# EAGLE design Base (EAGLE 6.4)
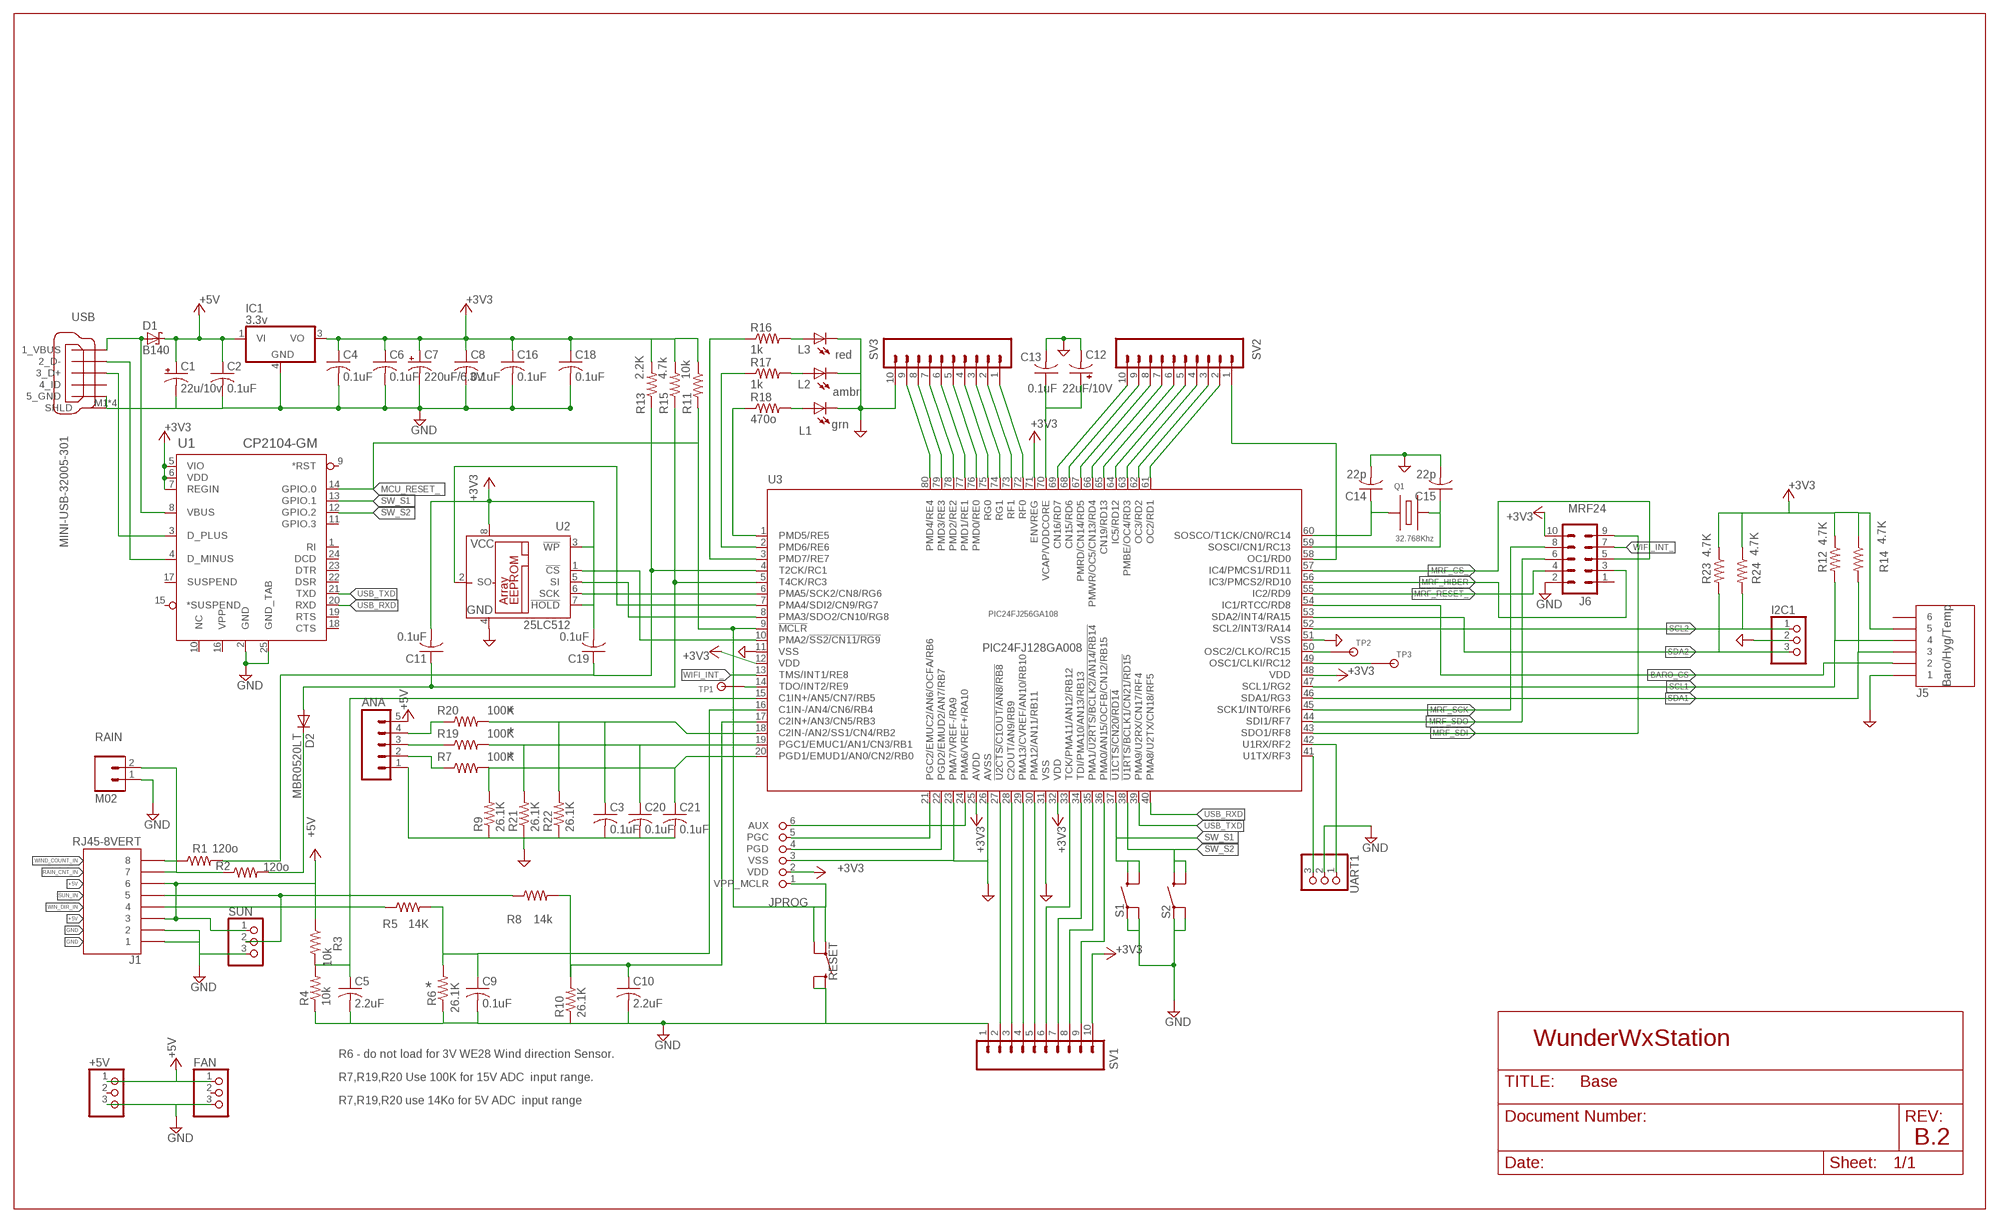
[diagram p0: schematic, sheet 1]

## Parts
+5V  PINHD-1X3MOLEX_KK  [1X3_MOLEX_KK]
ANA  M05PTH  [1X05]
C1  22u/10v  CPOL-USSMCB  [SMC_B]
C2  0.1uF  C-USC0805  [C0805]
C3  0.1uF  C-USC0805  [C0805]
C4  0.1uF  C-USC0805  [C0805]
C5  2.2uF  C-USC0805  [C0805]
C6  0.1uF  C-USC0805  [C0805]
C7  220uF/6.3V  CPOL-USSMCD  [SMC_D]
C8  0.1uF  C-USC0805  [C0805]
C9  0.1uF  C-USC0805  [C0805]
C10  2.2uF  C-USC0805  [C0805]
C11  0.1uF  C-USC0805  [C0805]
C12  22uF/10V  CPOL-USSMCB  [SMC_B]
C13  0.1uF  C-USC0805  [C0805]
C14  22p  C-USC0603  [C0603]
C15  22p  C-USC0603  [C0603]
C16  0.1uF  C-USC0805  [C0805]
C18  0.1uF  C-USC0805  [C0805]
C19  0.1uF  C-USC0805  [C0805]
C20  0.1uF  C-USC0805  [C0805]
C21  0.1uF  C-USC0805  [C0805]
D1  B140  SCHOTTKY-DIODESMD  [SMB]
D2  MBR0520LT  [SOD123]
FAN  PINHD-1X3MOLEX_KK  [1X3_MOLEX_KK]
I2C1  PINHD-1X3  [1X03]
IC1  3.3v  78MXXL  [DPACK]
J1  RJ45-8VERT  [RJ45_VERT]
J5  RJ11-6VERT_LP  [RJ11-6-VERT]
J6  M05X22X5FE  [2X5FEMALE]
JPROG  PIKIT2_PRG  [1X06_PIKIT]
L1  grn  LEDCHIP-LED0603  [CHIP-LED0603]
L2  ambr  LEDCHIP-LED0603  [CHIP-LED0603]
L3  red  LEDCHIP-LED0603  [CHIP-LED0603]
Q1  32.768Khz  CRYSTAL  [CRYSTAL32_SMT]
R1  120o  R-US_R0603  [R0603]
R2  120o  R-US_R0603  [R0603]
R3  10k  R-US_R0603  [R0603]
R4  10k  R-US_R0603  [R0603]
R5  14K  R-US_R0603  [R0603]
R6  26.1K  R-US_R0603  [R0603]
R7  100K  R-US_R0603  [R0603]
R8  14k  R-US_R0603  [R0603]
R9  26.1K  R-US_R0603  [R0603]
R10  26.1K  R-US_R0603  [R0603]
R11  10k  R-US_R0603  [R0603]
R12  4.7K  R-US_R0603  [R0603]
R13  2.2K  R-US_R0603  [R0603]
R14  4.7K  R-US_R0603  [R0603]
R15  4.7k  R-US_R0603  [R0603]
R16  1k  R-US_R0603  [R0603]
R17  1k  R-US_R0603  [R0603]
R18  470o  R-US_R0603  [R0603]
R19  100K  R-US_R0603  [R0603]
R20  100K  R-US_R0603  [R0603]
R21  26.1K  R-US_R0603  [R0603]
R22  26.1K  R-US_R0603  [R0603]
R23  4.7K  R-US_R0603  [R0603]
R24  4.7K  R-US_R0603  [R0603]
RAIN  M02  [1X02]
RESET  SWITCH-MOMENTARY-2SMD  [TACTILE_SWITCH_SMD]
S1  SWITCH-MOMENTARY-2SMD  [TACTILE_SWITCH_SMD]
S2  SWITCH-MOMENTARY-2SMD  [TACTILE_SWITCH_SMD]
SUN  PINHD-1X3MOLEX_KK  [1X3_MOLEX_KK]
SV1  M10"  [1X10]
SV2  M10"  [1X10]
SV3  M10"  [1X10]
TP1  TP10R  [TP10R]
TP2  TP6R  [TP06R]
TP3  TP6R  [TP06R]
U1  CP2104-GM  [QFN24_4X4]
U2  25LC512  25LC080SN  [SO-08]
U3  PIC24FJ128GA008  [TQFP80-12X12]
UART1  PINHD-1X3  [1X03]
USB  MINI-USB-32005-301  [32005-301]

## Nets
+3V3: C4.1 C6.1 C7.+ C8.1 C11.2 C16.1 C18.1 C19.2 IC1.3(VO) J5.P$5 J6.10 JPROG.2(VDD) R11.1 R12.1 R13.2 R14.1 R15.2 R23.1 R24.1 SV1.10 U1.5(VIO) U1.6(VDD) U1.7(REGIN) U2.3(!WP) U2.7(!HOLD) U2.8(VCC) U3.12(VDD) U3.25(AVDD) U3.32(VDD) U3.48(VDD) U3.71(ENVREG)
+5V: +5V.1 ANA.5 C1.+ C2.1 D1.C FAN.1 IC1.1(VI) J1.P$3 J1.P$6 R3.1 SUN.1
BARO_CS: J5.P$2 U3.54(IC1/RTCC/RD8)
GND: +5V.3 ANA.1 C1.- C2.2 C3.2 C4.2 C5.2 C6.2 C7.- C8.2 C9.2 C10.2 C12.- C13.2 C14.2 C15.2 C16.2 C18.2 C20.2 C21.2 FAN.3 I2C1.2 IC1.4(GND) J1.P$1 J1.P$2 J5.P$1 J6.2 JPROG.3(VSS) L1.C L2.C L3.C R4.1 R6.1 R9.1 R10.1 R21.1 R22.1 RAIN.1 RESET.3 RESET.4 S1.1 S1.2 S2.1 S2.2 SUN.3 SV1.1 SV3.10 U1.2(GND) U1.25(GND_TAB) U2.4(GND) U3.11(VSS) U3.23(PMA7/VREF-/RA9) U3.26(AVSS) U3.31(VSS) U3.51(VSS) UART1.2 USB.5_USB_GND(5_GND) USB.M1(SHLD) USB.M2(SHLD) USB.M3(SHLD) USB.M4(SHLD)
MCU_RESET_: JPROG.1(VPP_MCLR) R11.2 RESET.1 RESET.2 U1.14(GPIO.0) U3.9(!MCLR)
MRF_CS_: J6.5 U3.57(IC4/PMCS1/RD11)
MRF_HIBER: J6.3 U3.56(IC3/PMCS2/RD10)
MRF_RESET_: J6.4 U3.55(IC2/RD9)
MRF_SCK: J6.8 U3.45(SCK1/INT0/RF6)
MRF_SDI: J6.9 U3.43(SDO1/RF8)
MRF_SDO: J6.6 U3.44(SDI1/RF7)
N$1: D2.C R2.2
N$2: C15.1 Q1.P$3 U3.59(SOSCI/CN1/RC13)
N$4: TP2.TP_1 U3.50(OSC2/CLKO/RC15)
N$5: R18.1 U3.1(PMD5/RE5)
N$7: C14.1 Q1.P$2 U3.60(SOSCO/T1CK/CN0/RC14)
N$8: TP1.TP_1 U3.14(TDO/INT2/RE9)
N$9: D1.A U1.8(VBUS) USB.1_VBUS
N$10: SV2.2 U3.61(OC2/RD1)
N$11: SV2.3 U3.62(OC3/RD2)
N$12: SV2.4 U3.63(PMBE/OC4/RD3)
N$13: SV2.5 U3.64(IC5/RD12)
N$14: TP3.TP_1 U3.49(OSC1/CLKI/RC12)
N$15: SV2.6 U3.65(CN19/RD13)
N$16: JPROG.5(PGC) U3.21(PGC2/EMUC2/AN6/OCFA/RB6)
N$17: JPROG.4(PGD) U3.22(PGD2/EMUD2/AN7/RB7)
N$18: L3.A R16.2
N$19: C12.+ C13.1 U3.70(VCAP/VDDCORE)
N$20: L2.A R17.2
N$21: L1.A R18.2
N$22: C21.1 R7.2 R9.2 U3.20(PGD1/EMUD1/AN0/CN2/RB0)
N$23: ANA.4 R20.1
N$24: C20.1 R19.2 R21.2 U3.19(PGC1/EMUC1/AN1/CN3/RB1)
N$25: U2.2(SO) U3.7(PMA4/SDI2/CN9/RG7)
N$26: SV2.7 U3.66(PMWR/OC5/CN13/RD4)
N$27: U2.1(!CS) U3.10(PMA2/!SS2/CN11/RG9)
N$28: C3.1 R20.2 R22.2 U3.18(C2IN-/AN2/SS1/CN4/RB2)
N$29: U2.6(SCK) U3.6(PMA5/SCK2/CN8/RG6)
N$30: ANA.3 R19.1
N$31: ANA.2 R7.1
N$32: U2.5(SI) U3.8(PMA3/SDO2/CN10/RG8)
N$33: R17.1 U3.2(PMD6/RE6)
N$34: R16.1 U3.3(PMD7/RE7)
N$35: SV2.8 U3.67(PMRD/CN14/RD5)
N$36: SV2.9 U3.68(CN15/RD6)
N$40: SV2.10 U3.69(CN16/RD7)
N$41: SV3.1 U3.72(RF0)
N$42: SV2.1 U3.58(OC1/RD0)
N$44: U3.41(U1TX/RF3) UART1.3
N$45: U3.42(U1RX/RF2) UART1.1
N$47: SV1.2 U3.27(!U2CTS/C1OUT/AN8/RB8)
N$48: SV1.3 U3.28(C2OUT/AN9/RB9)
N$49: SV1.4 U3.29(PMA13/CVREF/AN10/RB10)
N$50: SV1.5 U3.30(PMA12/AN11/RB11)
N$51: SV1.6 U3.33(TCK/PMA11/AN12/RB12)
N$52: SV1.7 U3.34(TDI/PMA10/AN13/RB13)
N$53: SV1.8 U3.35(PMA1/!U2RTS/BCLK2/AN14/RB14)
N$54: SV1.9 U3.36(PMA0/AN15/OCFB/CN12/RB15)
N$55: SV3.2 U3.73(RF1)
N$56: SV3.3 U3.74(RG1)
N$57: SV3.4 U3.75(RG0)
N$58: SV3.5 U3.76(PMD0/RE0)
N$59: SV3.6 U3.77(PMD1/RE1)
N$60: SV3.7 U3.78(PMD2/RE2)
N$61: SV3.8 U3.79(PMD3/RE3)
N$62: SV3.9 U3.80(PMD4/RE4)
N$63: JPROG.6(AUX) U3.24(PMA6/VREF+/RA10)
N$66: C5.1 R3.2 R4.2 U3.15(C1IN+/AN5/CN7/RB5)
RAIN_CNT_IN: J1.P$7 R2.1 RAIN.2
RAIN_COUNT: C11.1 D2.A R15.1 U3.5(T4CK/RC3)
SCL1: J5.P$4 R12.2 U3.47(SCL1/RG2)
SCL2: I2C1.1 R24.2 U3.52(SCL2/INT3/RA14)
SDA1: J5.P$3 R14.2 U3.46(SDA1/RG3)
SDA2: I2C1.3 R23.2 U3.53(SDA2/INT4/RA15)
SUN_ADC_IN: C10.1 R8.2 R10.2 U3.17(C2IN+/AN3/CN5/RB3)
SUN_IN: J1.P$5 R8.1 SUN.2
SW_S1: S1.3 S1.4 U1.13(GPIO.1) U3.37(!U1CTS/CN20/RD14)
SW_S2: S2.3 S2.4 U1.12(GPIO.2) U3.38(!U1RTS/BCLK1/CN21/RD15)
USB_D+: U1.3(D_PLUS) USB.3_D+
USB_D-: U1.4(D_MINUS) USB.2_D-
USB_RXD: U1.20(RXD) U3.40(PMA8/U2TX/CN18/RF5)
USB_TXD: U1.21(TXD) U3.39(PMA9/U2RX/CN17/RF4)
WIFI_INT_: J6.7 U3.13(TMS/INT1/RE8)
WIN_DIR_IN: J1.P$4 R5.1
WIND_ADC_IN: C9.1 R5.2 R6.2 U3.16(C1IN-/AN4/CN6/RB4)
WIND_COUNT: C19.1 R1.2 R13.1 U3.4(T2CK/RC1)
WIND_COUNT_IN: J1.P$8 R1.1
Unconnected: +5V.2 FAN.2 J5.P$6 J6.1 U1.1(RI) U1.9(*RST) U1.10(NC) U1.11(GPIO.3) U1.15(*SUSPEND) U1.16(VPP) U1.17(SUSPEND) U1.18(CTS) U1.19(RTS) U1.22(DSR) U1.23(DTR) U1.24(DCD) USB.4_ID

## Notes on the sheet
- MRF24
- PIC24FJ256GA108
- Baro/Hyg/Temp
- *
- *
- *
- *
- WunderWxStation
- R6 - do not load for 3V WE28 Wind direction Sensor.
- R7,R19,R20 Use 100K for 15V ADC  input range.
- R7,R19,R20 use 14Ko for 5V ADC  input range
- B.2

## Library data of the parts
+5V FAN I2C1 SUN UART1 = wifi_WX:PINHD-1X3: PIN HEADER
ANA = wifi_WX:M05: Header 5 Standard 5-pin 0.1" header. Use with straight break away headers (SKU : PRT-00116), right angle break away headers (PRT-00553), swiss pins (PRT-00743), machine pins (PRT-00117), and female headers (PRT-00115). Molex polarized connector foot print use with SKU : PRT-08230 with associated crimp pins and housings.
C1 C7 C12 = rcl:CPOL-US: POLARIZED CAPACITOR, American symbol
C2-C6 C8-C11 C13-C16 C18-C21 = rcl:C-US: CAPACITOR, American symbol
D1 = diode:SCHOTTKY-DIODE: Schottky Diode
D2 = diode:MBR0520LT: SCHOTTKY BARRIER RECTIFIER Source: http://onsemi.com .. MBR0520LT1-D.pdf
IC1 = wifi_WX:78MXXL: VOLTAGE REGULATOR
J1 = wifi_WX:RJ45-8: RJ45 Jack Simple RJ45, 8-pin connection - connector for common Cat5, Cat5e, and Cat6 Ethernet cables. Footprint not yet proven in production. Connector sku is PRT-00643; Breakout PCB sku is BOB-00716.
J5 = wifi_WX:RJ11-6: Cat3, RJ11 6 pin socket
J6 = wifi_WX:M05X2: Header 5x2 Standard 10-pin dual row 0.1" header. Commonly used with AVR-ISP. Use with Spark Fun Electronics SKU: PRT-00778
JPROG = wifi_WX:PIKIT2_PRG: PIN HEADER
L1-L3 = led:LED: LED OSRAM: - CHIPLED LG R971, LG N971, LY N971, LG Q971, LY Q971, LO R971, LY R971 LH N974, LH R974 LS Q976, LO Q976, LY Q976 LO Q996 - Hyper CHIPLED LW Q18S LB Q993, LB Q99A, LB R99A - SideLED LS A670, LO A670, LY A670, LG A670, LP A670 LB A673, LV A673, LT A673, LW A673 LH A674 LY A675 LS A676, LA A676, LO A676, LY A676, LW A676 LS A679, LY A679, LG A679 - Hyper Micro SIDELED® LS Y876, LA Y876, LO Y876, LY Y876 LT Y87S - SmartLED LW L88C, LW L88S LB L89C, LB L89S, LG L890 LS L89K, LO L89K, LY L89K LS L896, LA L896, LO L896, LY L896 - TOPLED LS T670, LO T670, LY T670, LG T670, LP T670 LSG T670, LSP T670, LSY T670, LOP T670, LYG T670 LG T671, LOG T671, LSG T671 LB T673, LV T673, LT T673, LW T673 LH T674 LS T676, LA T676, LO T676, LY T676, LB T676, LH T676, LSB T676, LW T676 LB T67C, LV T67C, LT T67C, LS T67K, LO T67K, LY T67K, LW E67C LS E67B, LA E67B, LO E67B, LY E67B, LB E67C, LV E67C, LT E67C LW T67C LS T679, LY T679, LG T679 LS T770, LO T770, LY T770, LG T770, LP T770 LB T773, LV T773, LT T773, LW T773 LH T774 LS E675, LA E675, LY E675, LS T675 LS T776, LA T776, LO T776, LY T776, LB T776 LHGB T686 LT T68C, LB T68C - Hyper Mini TOPLED® LB M676 - Mini TOPLED Santana® LG M470 LS M47K, LO M47K, LY M47K Source: http://www.osram.convergy.de LUXEON: - LUMILED® LXK2-PW12-R00, LXK2-PW12-S00, LXK2-PW14-U00, LXK2-PW14-V00 LXK2-PM12-R00, LXK2-PM12-S00, LXK2-PM14-U00 LXK2-PE12-Q00, LXK2-PE12-R00, LXK2-PE12-S00, LXK2-PE14-T00, LXK2-PE14-U00 LXK2-PB12-K00, LXK2-PB12-L00, LXK2-PB12-M00, LXK2-PB14-N00, LXK2-PB14-P00, LXK2-PB14-Q00 LXK2-PR12-L00, LXK2-PR12-M00, LXK2-PR14-Q00, LXK2-PR14-R00 LXK2-PD12-Q00, LXK2-PD12-R00, LXK2-PD12-S00 LXK2-PH12-R00, LXK2-PH12-S00 LXK2-PL12-P00, LXK2-PL12-Q00, LXK2-PL12-R00 Source: www.luxeon.com KINGBRIGHT: KA-3528ASYC Source: www.kingbright.com
Q1 = wifi_WX:CRYSTAL
R1-R24 = rcl:R-US_: RESISTOR, American symbol
RAIN = wifi_WX:M02
RESET S1 S2 = wifi_WX:SWITCH-MOMENTARY-2: Various NO switches- pushbuttons, reed, etc
SV1-SV3 = wifi_WX:M10: Header 10 Standard 10-pin 0.1" header. Use with straight break away headers (SKU : PRT-00116), right angle break away headers (PRT-00553), swiss pins (PRT-00743), machine pins (PRT-00117), and female headers (PRT-00115).
TP1-TP3 = wifi_WX:TP
U1 = wifi_WX:CP2104-GM
U2 = microchip:25*: Serial EEPROM 4K/ 8K , SPI bus; MF: MICROCHIP; MPN: 25LC080/SN; OC_FARNELL: 1137302; OC_NEWARK: 96K4092
U3 = wifi_WX:PIC24FJ*GA008: 64/80/100-Pin General Purpose, 16-Bit Flash Microcontrollers Source: http://ww1.microchip.com/downloads/en/DeviceDoc/39747d.pdf; MF: MICROCHIP; MPN: PIC24FJ128GA008-I/PT; OC_FARNELL: 1146521; OC_NEWARK: 56K7339
USB = wifi_WX:MINI-USB-: MINI USB-B Conector Source: www.cypressindustries.com

## Board
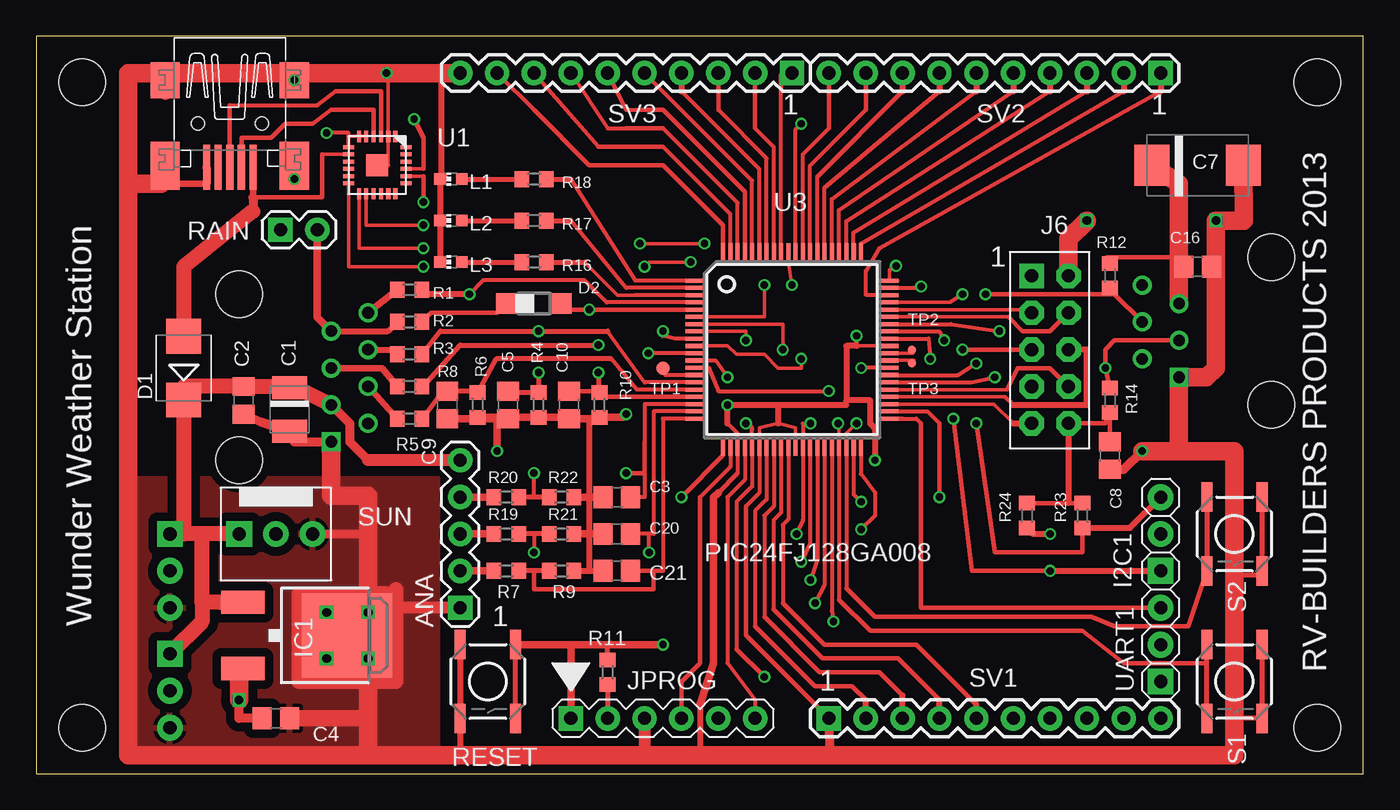
[diagram p1: board, top side]
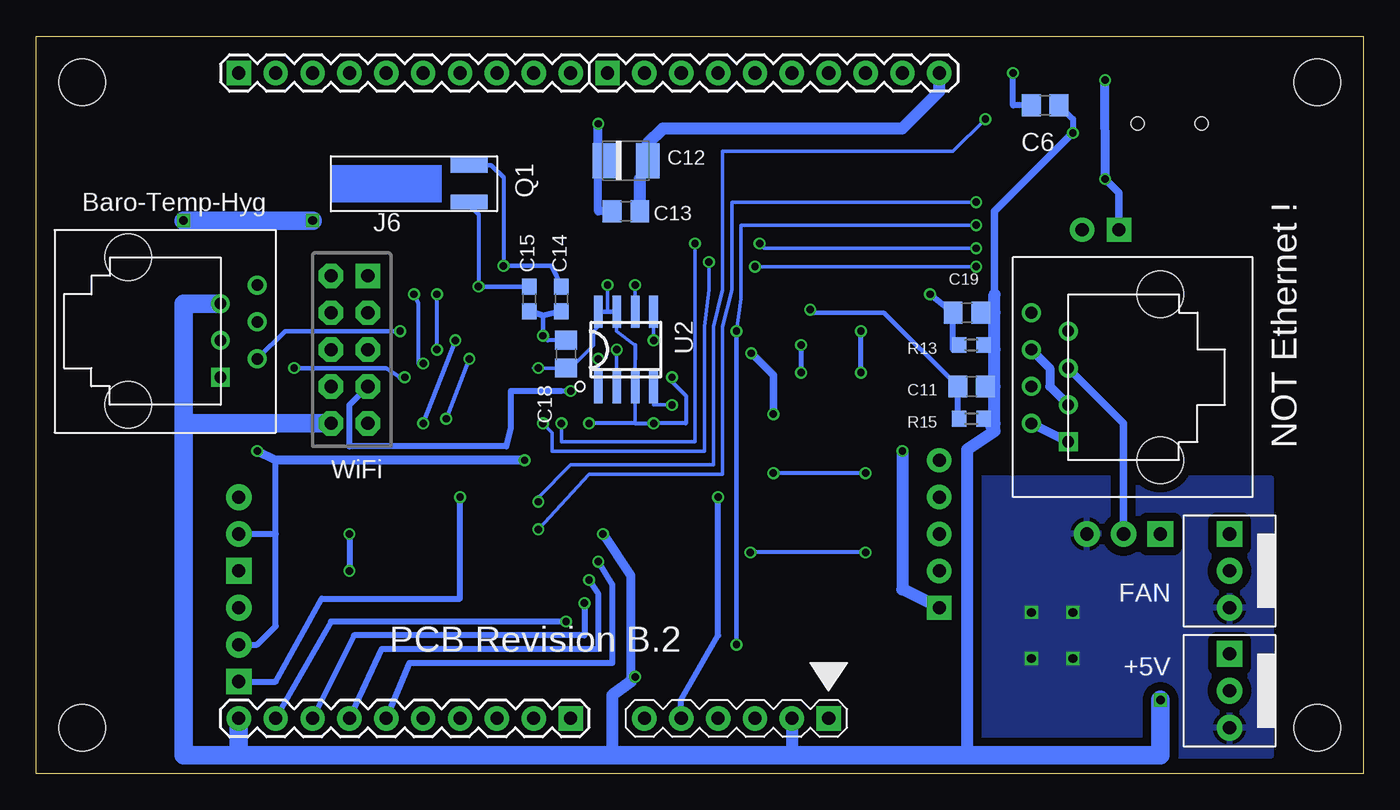
[diagram p2: board, bottom side, seen from below]

Size 91.43 x 50.79 mm. Coordinates in mm from the lower left corner, seen from the top.
Outline: 0,0 91.43,0 91.43,50.79 0,50.79 0,0
Copper layers (1*16): Top 0.035mm / dielectric 1.5mm / Bottom 0.035mm
Design rules "Elecrow_2-layer_with reduced cream mask *": minimum track width 6mil, minimum drill 12mil, track to track 6mil, track to pad 6mil, pad to pad 6mil, via to via 6mil, smd to smd 0mil, copper to edge 10mil, drill to drill 10mil, minimum pad ring 10mil, minimum via ring 6mil, stop-mask expansion 2mil, vias tented up to drill 100mil, thermal gap 10mil
Holes 3.2 mm at 3.17,47.62 3.17,3.17 88.27,3.17 88.27,47.62

### Footprints (pad centres in the part's own frame; a part is rotated, then mirrored left to right if it is on the bottom)
1X3_MOLEX_KK = drill 0.9 pad 1.778 square: 1 1.27,3.175 | drill 0.9 pad 1.778: 2 3.81,3.175; 3 6.35,3.175
1X05 = drill 0.9 pad 1.676 square: 1 0,0 | drill 0.9 pad 1.676: 2 2.54,0; 3 5.08,0; 4 7.62,0; 5 10.16,0
SMC_B = smd 1.6 x 2.4: + -1.5,0; - 1.5,0
C0805 = smd 1.3 x 1.5: 1 -0.95,0; 2 0.95,0
SMC_D = smd 2.4 x 2.8: + -3.15,0; - 3.15,0
C0603 = smd 1.1 x 1: 1 -0.85,0; 2 0.85,0
SMB = smd 2.4 x 2.4: A 2.2,0; C -2.2,0
SOD123 = smd 1.4 x 1.4: A 1.9,0; C -1.9,0
1X03 = drill 0.9 pad 1.778 square: 1 -2.54,0 | drill 0.9 pad 1.778: 2 0,0; 3 2.54,0
DPACK = smd 1.6 x 3: 1 -2.28,-4.8; 3 2.28,-4.8 | smd 5.8 x 6.2: 4 0,2.38
RJ45_VERT = drill 0.8 square: P$1 1.27,6.35 | drill 0.8: P$2 2.54,8.89; P$3 3.81,6.35; P$4 5.08,8.89; P$5 6.35,6.35; P$6 7.62,8.89; P$7 8.89,6.35; P$8 10.16,8.89 | hole 3.2: 0,0; 11.43,0
RJ11-6-VERT = drill 0.8 square: P$1 3.175,3.81 | drill 0.8: P$2 1.905,6.35; P$3 0.635,3.81; P$4 -0.635,6.35; P$5 -1.905,3.81; P$6 -3.175,6.35 | hole 3.2: -5.08,-2.54; 5.08,-2.54
2X5FEMALE = drill 0.9 pad 1.676 square: 1 -1.27,5.08 | drill 0.9 pad 1.676 octagon: 2 1.27,5.08; 3 -1.27,2.54; 4 1.27,2.54; 5 -1.27,0; 6 1.27,0; 7 -1.27,-2.54; 8 1.27,-2.54; 9 -1.27,-5.08; 10 1.27,-5.08
1X06_PIKIT = drill 0.9 pad 1.676 square: 1 -6.35,0 | drill 0.9 pad 1.676: 2 -3.81,0; 3 -1.27,0; 4 1.27,0; 5 3.81,0; 6 6.35,0
CHIP-LED0603 = smd 0.8 x 0.8: A 0,-0.75; C 0,0.75
CRYSTAL32_SMT = smd 2.54 x 1.016: P$2 1.905,1.27; P$3 1.905,-1.27
R0603 = smd 1 x 1.1: 1 -0.85,0; 2 0.85,0
1X02 = drill 0.9 pad 1.676 square: 1 -5.08,0 | drill 0.9 pad 1.676: 2 -2.54,0
TACTILE_SWITCH_SMD = smd 2.032 x 0.762: 1 -2.54,1.905; 2 2.54,1.905; 3 -2.54,-1.905; 4 2.54,-1.905
1X10 = drill 0.9 pad 1.676 square: 1 0,0 | drill 0.9 pad 1.676: 2 2.54,0; 3 5.08,0; 4 7.62,0; 5 10.16,0; 6 12.7,0; 7 15.24,0; 8 17.78,0; 9 20.32,0; 10 22.86,0
TP10R = smd 0.914 x 0.914: TP_1 0,0
TP06R = smd 0.6 x 0.6: TP_1 0,0
QFN24_4X4 = smd 0.762 x 0.279: 1 -1.98,1.245; 2 -1.98,0.762; 3 -1.98,0.254; 4 -1.98,-0.254; 5 -1.98,-0.762; 6 -1.98,-1.245; 13 1.98,-1.245; 14 1.98,-0.762; 15 1.98,-0.254; 16 1.98,0.254; 17 1.98,0.762; 18 1.98,1.245 | smd 0.279 x 0.762: 7 -1.245,-1.98; 8 -0.762,-1.98; 9 -0.254,-1.98; 10 0.254,-1.98; 11 0.762,-1.98; 12 1.245,-1.98; 19 1.245,1.98; 20 0.762,1.98; 21 0.254,1.98; 22 -0.254,1.98; 23 -0.762,1.98; 24 -1.245,1.98 | smd 1.524 x 1.524: 25 0,0
SO-08 = smd 0.6 x 2.2: 1 -1.905,-2.6; 2 -0.635,-2.6; 3 0.635,-2.6; 4 1.905,-2.6; 5 1.905,2.6; 6 0.635,2.6; 7 -0.635,2.6; 8 -1.905,2.6
TQFP80-12X12 = smd 1.194 x 0.279: 1 -6.725,4.75; 2 -6.725,4.25; 3 -6.725,3.75; 4 -6.725,3.25; 5 -6.725,2.75; 6 -6.725,2.25; 7 -6.725,1.75; 8 -6.725,1.25; 9 -6.725,0.75; 10 -6.725,0.25; 11 -6.725,-0.25; 12 -6.725,-0.75; 13 -6.725,-1.25; 14 -6.725,-1.75; 15 -6.725,-2.25; 16 -6.725,-2.75; 17 -6.725,-3.25; 18 -6.725,-3.75; 19 -6.725,-4.25; 20 -6.725,-4.75; 41 6.725,-4.75; 42 6.725,-4.25; 43 6.725,-3.75; 44 6.725,-3.25; 45 6.725,-2.75; 46 6.725,-2.25; 47 6.725,-1.75; 48 6.725,-1.25; 49 6.725,-0.75; 50 6.725,-0.25; 51 6.725,0.25; 52 6.725,0.75; 53 6.725,1.25; 54 6.725,1.75; 55 6.725,2.25; 56 6.725,2.75; 57 6.725,3.25; 58 6.725,3.75; 59 6.725,4.25; 60 6.725,4.75 | smd 0.279 x 1.194: 21 -4.75,-6.725; 22 -4.25,-6.725; 23 -3.75,-6.725; 24 -3.25,-6.725; 25 -2.75,-6.725; 26 -2.25,-6.725; 27 -1.75,-6.725; 28 -1.25,-6.725; 29 -0.75,-6.725; 30 -0.25,-6.725; 31 0.25,-6.725; 32 0.75,-6.725; 33 1.25,-6.725; 34 1.75,-6.725; 35 2.25,-6.725; 36 2.75,-6.725; 37 3.25,-6.725; 38 3.75,-6.725; 39 4.25,-6.725; 40 4.75,-6.725; 61 4.75,6.725; 62 4.25,6.725; 63 3.75,6.725; 64 3.25,6.725; 65 2.75,6.725; 66 2.25,6.725; 67 1.75,6.725; 68 1.25,6.725; 69 0.75,6.725; 70 0.25,6.725; 71 -0.25,6.725; 72 -0.75,6.725; 73 -1.25,6.725; 74 -1.75,6.725; 75 -2.25,6.725; 76 -2.75,6.725; 77 -3.25,6.725; 78 -3.75,6.725; 79 -4.25,6.725; 80 -4.75,6.725
32005-301 = smd 3.1 x 0.5: 1_VBUS 3,1.6; 2_D- 3,0.8; 3_D+ 3,0; 4_ID 3,-0.8; 5_USB_GND 3,-1.6 | smd 2.5 x 2: M1 -3,-4.45; M2 -3,4.45 | smd 3.3 x 2: M3 2.9,4.45; M4 2.9,-4.45 | hole 0.9: 0,2.2; 0,-2.2

### Placement (x,y rotation side)
+5V  12.38,9.53 270 bottom
ANA  29.21,11.43 90 top
C1  17.46,25.08 270 top
C2  14.29,25.72 270 top
C3  40.01,19.05 180 top
C4  16.51,3.81 0 top
C5  32.51,25.4 270 top
C6  21.91,46.04 180 bottom
C7  80.01,41.91 0 top
C8  73.98,21.91 270 top
C9  28.32,25.4 270 top
C10  36.7,25.4 270 top
C11  26.99,26.67 0 bottom
C12  50.8,42.23 0 bottom
C13  50.8,38.73 0 bottom
C14  55.24,32.7 270 bottom
C15  57.47,32.7 270 bottom
C16  80.01,34.92 0 top
C18  54.93,28.89 90 bottom
C19  27.3,31.75 0 bottom
C20  40.01,16.51 180 top
C21  40.01,13.97 180 top
D1  10.16,27.94 90 top
D2  34.29,32.38 0 top
FAN  12.38,17.78 270 bottom
I2C1  77.47,16.51 90 top
IC1  19.05,9.53 270 top
J1  13.97,21.59 90 bottom
J5  82.55,30.48 270 bottom
J6  69.85,29.21 0 top
JPROG  43.18,3.81 180 bottom
L1  28.57,40.96 90 top
L2  28.57,38.1 90 top
L3  28.57,35.24 90 top
Q1  63.5,40.64 0 bottom
R1  25.72,33.34 0 top
R2  25.72,31.11 0 top
R3  25.72,28.89 0 top
R4  34.61,25.4 90 top
R5  25.72,24.45 0 top
R6  30.42,25.4 90 top
R7  32.38,13.97 0 top
R8  25.72,26.67 0 top
R9  36.2,13.97 180 top
R10  38.8,25.4 90 top
R11  39.37,6.99 90 top
R12  73.98,34.29 270 top
R13  26.99,29.53 0 bottom
R14  73.98,25.72 90 top
R15  26.99,24.45 0 bottom
R16  34.29,35.24 180 top
R17  34.29,38.1 180 top
R18  34.29,40.96 180 top
R19  32.38,16.51 0 top
R20  32.38,19.05 0 top
R21  36.2,16.51 180 top
R22  36.2,19.05 180 top
R23  72.07,17.78 270 top
R24  68.26,17.78 270 top
RAIN  21.91,37.47 0 top
RESET  31.11,6.35 270 top
S1  82.55,6.35 270 top
S2  82.55,16.51 270 top
SUN  12.7,13.34 0 top
SV1  54.61,3.81 180 bottom
SV2  77.47,48.26 0 bottom
SV3  52.07,48.26 0 bottom
TP1  43.18,27.94 0 top
TP2  60.33,29.21 0 top
TP3  60.33,28.26 0 top
U1  23.5,41.91 270 top
U2  50.8,29.21 0 bottom
U3  52.07,29.21 0 top
UART1  77.47,8.89 90 top
USB  13.34,44.77 270 top

### Tracks (layer width: path | path; a pad name or v marks a point on that pad's centre or on a via)
+3V3  (via drill 0.51, 0.6)
  Top 0.254: U3.71 51.82,35.17 v52.07,33.66 | U3.32 52.82,24.13 v53.34,24.13 | U1.5 U1.6 21.52,43.89 U1.7
  Top 0.279: U3.12 46.79,28.46 v47.62,27.3 | U3.48 57.17,27.96 v56.83,27.94 | 48.26,8.57 48.26,18.73 49.32,19.79 U3.25 49.32,23.7 arc90 v48.9,24.13 | 52.82,24.13 52.82,17.46 v52.39,16.51 | 13.97,5.34 v13.97,5.08 | U1.7 21.52,44.13 v20,44.13
  Top 0.305: 48.26,8.57 v50.16,6.67 | R24.1 71.12,18.63 R23.1 | J6.10 73.66,24.13 R14.1 C8.1 | R12.1 73.76,35.56 78.74,35.56
  Top 0.356: R11.1 JPROG.2
  Top 0.406: J6.10 71.12,18.63 | C8.1 73.66,22.86 | C16.1 79.06,35.56 78.74,35.56
  Top 0.61: C4.1 13.97,3.81 v13.97,5.08
  Top 0.813: C8.1
  Top 1.27: IC1.3 13.97,7.25 v13.97,5.08 | C7.+ 78.74,40.64 78.74,35.56 J5.P$5
  Bottom 0.254: v52.07,33.66 52.07,31.81 | U2.7 51.44,30.48 50.16,29.53 U2.3 50.16,24.13 | v56.83,27.94 54.61,27.94 53.02,29.53 53.02,30.48 52.7,30.8 U2.8
  Bottom 0.279: 50.16,29.53 50.16,28.57 | v47.62,27.3 47.62,26.99 46.67,26.04 46.67,24.13 v48.9,24.13 50.16,24.13 v53.34,24.13 | 57.15,27.94 v56.83,27.94 | 51.75,1.27 52.06,1.27 50.83,1.27 50.48,1.3 50.48,1.27
  Bottom 0.305: U2.8 52.07,31.81 U2.7 | 54.61,27.94 C18.1 arc90 C18.1
  Bottom 0.406: 25.4,24.13 25.72,23.81 25.82,23.81 R15.2 | C19.2 25.4,31.75 | 25.4,29.21 R13.2 | C11.2 25.4,26.67 | C6.1 20,45.08 v20,44.13
  Bottom 0.508: 25.4,33.02 25.4,38.73 v20,44.13
  Bottom 0.61: v52.39,16.51 50.48,13.65 50.48,6.67 | 50.48,6.67 50.48,6.35 | v50.16,6.67 50.48,6.67
  Bottom 0.813: JPROG.2 39.37,1.27 | 25.4,33.02 25.4,31.75 25.4,29.21 25.4,26.67 25.4,24.13 25.4,23.6 27.3,22.33 27.3,1.27 | 50.48,6.35 51.75,5.4 51.75,1.27
  Bottom 1.27: 77.47,1.27 51.75,1.27 50.48,1.27 39.37,1.27 27.3,1.27 13.97,1.27 v13.97,5.08 | SV1.10 77.47,1.27 | 77.47,1.27 81.28,1.27 81.28,24.13 | 81.28,24.13 81.28,32.38 J5.P$5 | J6.10 81.28,24.13
+5V
  Top 0.406: J1.P$6 24.55,29.21 R3.1
  Top 0.61: 10.16,26.67 D1.C | J1.P$3 21.59,24.13 21.59,22.86 22.86,21.59
  Top 0.813: 17.78,26.67 C1.+ 17.38,26.67 | C2.1 | 12.7,11.8 IC1.1 | ANA.5 22.86,21.59
  Top 1.016: D1.C 10.16,16.51 | J1.P$3 17.78,26.67 | SUN.1 11.43,16.51 | 11.43,16.51 10.16,16.51 | 17.38,26.67 C2.1 | C2.1 10.16,26.67 | 12.7,11.8 11.43,11.8 | 11.43,11.8 11.43,16.51 | FAN.1 10.16,16.51 | 11.43,11.8 11.43,10.48 +5V.1
  Bottom 0.61: J1.P$6 21.59,27.94 21.59,26.67 J1.P$3
BARO_CS  (via drill 0.51)
  Top 0.279: U3.54 63.02,30.96 v66.36,30.48
  Bottom 0.305: v66.36,30.48 74.3,30.48 J5.P$2
GND  (via drill 0.51, 0.6)
  Top 0.254: U3.31 52.32,23.81 51.12,24.13 49.82,23.81 49.82,22.51 U3.26 | U3.51 56.52,29.46 | 24.26,41.91 U1.2 24.26,48.26
  Top 0.279: U3.23 48.32,23.43 47.62,24.13 | 48.31,22.28 48.31,20.69 | 49.82,21.96 49.82,19.34 48.9,18.41 | 24.03,8.99 v22.86,7.94 IC1.4 | 55.82,25.72 arc90 55.82,25.72 | 55.82,25.72 55.82,25.4 | U3.11 v42.16,28.96 | v40.64,24.77 40.42,24.55
  Top 0.305: v56.52,30.16 56.52,29.46 | 48.31,20.69 46.99,19.37 | 25.53,48.13 v24.13,48.26 24.26,48.26 | 24.26,41.91 U1.25 | 48.9,18.41 48.9,9.53 SV1.1 | C5.2 33.02,24.55 | R6.1 30.7,24.45 | 36.6,24.55 C10.2 | 38.7,24.45 R10.1 | USB.M3 v17.78,40.96 | USB.M2 17.78,48.26
  Top 0.356: S2.2 S2.1 84.45,13.65 82.87,13.65 82.55,13.97 | 82.55,3.81 S1.2 S1.1 | RESET.4 RESET.3
  Top 0.406: 51.12,25.4 51.12,24.13 | 56.52,29.46 55.81,29.46 55.82,25.72 57.47,25.72 57.47,24.13 57.78,23.75 v57.78,21.59 | 47.62,24.13 v47.62,25.4 51.12,25.4 | 51.12,25.4 55.82,25.4 | 45.72,4.76 45.72,1.27 | USB.M2 SV3.10 | SV1.1 54.61,1.27 | L1.C L2.C L3.C | 52.07,1.27 54.72,1.06 | 27.94,41.07 27.94,48.26 | 22.86,8.89 v22.86,11.11 | RESET.3 29.21,1.27 | R9.1 38.1,13.97 | 38.1,13.97 C21.2 | 38.1,13.97 38.1,16.51 38.1,19.05 38.1,24.45 | C16.2 80.96,35.56 81.28,35.56
  Top 0.457: 11.73,40.6 11.73,40.64 7.62,40.64
  Top 0.508: 46.99,19.37 46.67,19.05 46.67,7.62 45.72,4.76 | R6.1 33.02,24.55 R4.1 36.6,24.55 | 30.7,24.45 C9.2 31.75,24.45 v31.75,22.23 | C10.2 38.1,24.45 38.7,24.45 | 40.42,24.55 R10.1 | R22.1 38.1,19.05 C3.2 | R21.1 38.1,16.51 C20.2
  Top 0.559: USB.5_USB_GND 11.73,40.6 | 8.89,40.64 USB.M4
  Top 0.61: SUN.3 22.86,16.51 | C2.2 15.46,24.23 C1.- 17.78,22.86 J1.P$1 | 54.72,1.06 SV1.1 | USB.M1 8.39,48.26 6.35,48.26 | C8.2 74.93,20.96 v76.2,22.23 | 82.23,38.1 82.55,38.1
  Top 0.813: JPROG.3 41.91,1.27 | USB.M4 8.61,40.64 | USB.M1 8.89,46.82 | L1.C 27.94,41.07 | ANA.1 24.77,11.43
  Top 1.016: 24.77,12.7 24.77,11.43 24.77,6.35 18.1,6.35 18.1,12.38 22.86,12.38 | 24.13,12.38 22.86,12.38 | 22.86,12.38 v22.86,11.11
  Top 1.143: C4.2 22.86,3.81
  Top 1.27: 22.86,1.27 29.21,1.27 41.91,1.27 45.72,1.27 54.61,1.27 82.55,1.27 82.55,3.81 82.55,13.97 82.55,22.23 78.74,22.23 | 22.86,1.27 6.35,1.27 6.35,40.64 | 6.35,40.64 6.35,48.26 17.78,48.26 SV3.10 | 22.86,1.27 22.86,3.81 v22.86,7.94 v22.86,11.11 22.86,11.43 | 22.86,11.43 22.86,16.51 22.86,19.15 20.32,19.15 J1.P$1 | 8.61,40.64 7.62,40.64 6.35,40.64 | SV3.10 v24.13,48.26 27.94,48.26 SV3.10 | 22.86,11.43 20,11.43 v20,11.11 | v76.2,22.23 78.74,22.23 | C7.- 83.19,38.1 82.23,38.1 v81.28,38.1 81.28,35.56 81.28,27.94 80.62,27.3 J5.P$1 78.74,22.23 | J6.2 71.12,36.83 v72.39,38.1
  Bottom 0.254: U2.4 48.9,25.4 v47.62,25.4
  Bottom 0.279: C18.2 56.2,29.84 v56.52,30.16 | C12.- 49.85,40.96
  Bottom 0.305: 56.52,31.54 v56.52,30.16
  Bottom 0.406: C14.2 56.52,31.54 C15.2 | C6.2 24.13,46.04 v24.13,48.26 | 61.59,21.59 62.23,21.59 | I2C1.2 74.93,16.51 | 74.93,16.51 74.93,21.59 | UART1.2 76.2,8.89 74.93,10.16 74.93,16.51
  Bottom 0.508: v40.64,24.77 40.64,27.44 v42.16,28.96 | 17.46,40.64 v17.78,40.96 16.83,40.01 RAIN.1
  Bottom 0.61: v57.78,21.59 62.23,21.59 74.93,21.59 v76.2,22.23 | v17.78,40.96 USB.M2 | J1.P$2 J1.P$1
  Bottom 0.813: 49.85,40.96 C13.2 | C12.- 49.3,43.41 48.26,44.45 31.75,44.45 29.21,46.99 SV3.10 | v31.75,22.23 31.75,12.7 ANA.1
  Bottom 1.27: v72.39,38.1 v81.28,38.1
  other vias: 20,7.94 17.79,47.77
  pour Bottom (isolate 0.61): 6.35,1.27 6.35,20.32 27.94,20.32 27.94,1.27
  pour Top (isolate 0.61): 6.35,20.32 27.62,20.32 27.62,1.27 6.35,1.27
MCU_RESET_  (via drill 0.51)
  Top 0.254: U1.14 22.73,37.78 v26.67,37.78
  Top 0.279: U3.9 44.02,29.96 43.18,30.16
  Top 0.305: 43.18,30.16 v43.18,30.48
  Top 0.356: R11.2 39.37,8.89 | RESET.2 RESET.1
  Top 0.508: RESET.1 36.83,8.89 | 36.83,8.89 JPROG.1 | v43.18,8.89 39.37,8.89 36.83,8.89
  Bottom 0.254: v26.67,37.78 42.86,37.78 42.86,32.7 v43.18,30.48
  Bottom 0.305: v43.18,30.48 v43.18,8.89
MRF_CS_  (via drill 0.51)
  Top 0.254: U3.57 62.94,32.46 v63.82,33.02
  Top 0.305: v63.82,29.21 J6.5
  Bottom 0.279: v63.82,29.21 v63.82,33.02
MRF_HIBER
  Top 0.254: U3.56 68.37,31.96
  Top 0.406: 68.37,31.96 J6.3
MRF_RESET_
  Top 0.254: U3.55 66.97,31.46
  Top 0.279: 66.97,31.46 67.94,30.48
  Top 0.305: 67.94,30.48 69.85,30.48 J6.4
MRF_SCK
  Top 0.254: U3.45 66.89,26.46
  Top 0.279: 66.89,26.46 67.63,27.94
  Top 0.305: 67.63,27.94 69.85,27.94 J6.8
MRF_SDI
  Top 0.254: U3.43 65.98,25.46 67.31,24.13
  Top 0.406: 67.31,24.13 J6.9
MRF_SDO
  Top 0.254: U3.44 66.75,25.96
  Top 0.279: 66.75,25.96 67.31,25.4
  Top 0.406: 67.31,25.4 72.39,25.4 72.39,29.21 J6.6
N$1
  Top 0.305: R2.2 27.2,31.75 31.75,31.75 D2.C
N$2  (via drill 0.51)
  Top 0.279: U3.59 60.87,33.46 arc90 v60.96,33.55
  Bottom 0.279: 60.96,38.53 v60.96,33.55
  Bottom 0.305: C15.1 v60.96,33.55 | 60.96,38.53 61.59,39.17 Q1.P$3
N$4
  Top 0.254: U3.50 60.39,28.96
  Top 0.279: TP2.TP_1 TP2.TP_1 arc-45 60.39,29.06 60.39,28.96
N$5
  Top 0.279: U3.1 41.27,33.96 36.83,40.96
  Top 0.356: R18.1 36.83,40.96
N$7  (via drill 0.51)
  Top 0.254: 59.37,33.96 U3.60 58.8,34.66
  Top 0.279: 58.8,34.66 59.05,34.92 arc-45 59.19,34.98 v59.24,34.98
  Bottom 0.279: 59.24,41.07 v59.24,34.98
  Bottom 0.305: C14.1 55.88,34.92 55.94,34.98 v59.24,34.98 | 59.24,41.07 60.08,41.91 Q1.P$2
N$8
  Top 0.279: U3.14 43.34,27.46 43.34,27.69 arc45 43.28,27.84 TP1.TP_1
N$9
  Top 0.254: U1.8 19.68,42.67
  Top 0.279: 10.16,30.48 D1.A
  Top 0.305: 19.68,42.67 19.68,39.69 14.94,39.69
  Top 0.457: USB.1_VBUS 14.94,39.69 | 14.94,38.73 14.92,38.73
  Top 0.61: 14.94,39.69 14.94,38.73
  Top 1.016: 10.16,30.48 10.16,34.92 14.92,38.73
N$10
  Top 0.279: U3.61 56.82,36.5
  Top 0.305: 56.82,36.5 74.93,46.99
  Top 0.406: SV2.2 74.93,46.99
N$11
  Top 0.279: U3.62 56.32,37.27
  Top 0.305: 56.32,37.27 72.39,46.99
  Top 0.406: SV2.3 72.39,46.99
N$12
  Top 0.279: U3.63 55.82,38.04
  Top 0.305: 55.82,38.04 69.85,46.99
  Top 0.406: SV2.4 69.85,46.99
N$13
  Top 0.279: U3.64 55.32,38.81
  Top 0.305: 55.32,38.81 67.31,46.99
  Top 0.406: SV2.5 67.31,46.99
N$14
  Top 0.254: U3.49 60.44,28.46
  Top 0.279: TP3.TP_1 arc90 60.44,28.37 60.44,28.46
N$15
  Top 0.279: U3.65 54.82,39.58
  Top 0.305: 54.82,39.58 64.77,46.99
  Top 0.406: SV2.6 64.77,46.99
N$16  (via drill 0.51)
  Top 0.305: U3.21 47.32,21.92 v44.45,19.05
  Bottom 0.406: JPROG.5 46.99,5.08 44.45,9.53 v44.45,19.05
N$17
  Top 0.279: U3.22 47.82,21.15 45.72,19.05
  Top 0.305: JPROG.4 44.45,6.35 45.72,7.62 45.72,19.05
N$18
  Top 0.356: L3.A R16.2
N$19  (via drill 0.51)
  Top 0.279: U3.70 52.32,44.38 v52.7,44.77
  Bottom 0.559: v52.7,44.77 52.7,38.73 C13.1
  Bottom 0.61: C12.+ 52.7,42.23 v52.7,44.77
N$20
  Top 0.356: L2.A R17.2
N$21
  Top 0.356: L1.A R18.2
N$22
  Top 0.279: U3.20 43.18,24.46 43.18,13.97
  Top 0.305: 43.18,13.97 42.55,13.97 | 42.55,13.97 C21.1 | R9.2 34.29,13.97 34.29,12.7 42.55,12.7 42.55,13.97
  Top 0.356: R9.2 R7.2
N$23
  Top 0.508: ANA.4 R20.1
N$24  (via drill 0.51)
  Top 0.279: U3.19 42.55,24.96 42.55,16.51 42.23,16.51 | 42.23,16.51 C20.1 | 34.29,16.51 v34.29,15.24 | v42.23,15.24 42.23,16.51
  Top 0.356: R21.2 34.29,16.51 R19.2
  Bottom 0.279: v34.29,15.24 v42.23,15.24
N$25  (via drill 0.51)
  Top 0.254: U3.7 51.44,30.96 v51.44,29.21
  Bottom 0.254: v51.44,29.21 U2.2
N$26
  Top 0.279: U3.66 54.32,40.35
  Top 0.305: 54.32,40.35 62.23,46.99
  Top 0.406: SV2.7 62.23,46.99
N$27  (via drill 0.51)
  Top 0.254: U3.10 47.62,29.46 48.26,28.89 50.16,28.89 51.12,27.94 52.7,27.94 v52.7,28.57
  Bottom 0.254: v52.7,28.57 U2.1
N$28  (via drill 0.51)
  Top 0.279: U3.18 41.91,25.46 41.91,20.7 41.91,19.05 C3.1 | 34.29,19.05 v34.29,20.7
  Top 0.305: v40.64,20.7 41.91,20.7 41.91,22.86
  Top 0.356: R22.2 34.29,19.05 R20.2
  Bottom 0.279: v34.29,20.7 v40.64,20.7
N$29  (via drill 0.51)
  Top 0.254: U3.6 50.16,31.46 v50.16,33.66
  Bottom 0.254: v50.16,33.66 U2.6
N$30
  Top 0.508: ANA.3 R19.1
N$31
  Top 0.508: ANA.2 R7.1
N$32  (via drill 0.51)
  Top 0.254: U3.8 48.9,30.46 v48.9,29.84
  Bottom 0.254: v48.9,29.84 U2.5
N$33
  Top 0.279: U3.2 40.64,33.46 36.83,38.1
  Top 0.356: R17.1 36.83,38.1
N$34
  Top 0.254: 37.78,35.24 40.06,32.96 41.27,32.96
  Top 0.279: U3.3 41.27,32.96
  Top 0.356: R16.1 37.78,35.24
N$35
  Top 0.279: U3.67 53.82,41.12
  Top 0.305: 53.82,41.12 59.69,46.99
  Top 0.406: SV2.8 59.69,46.99
N$36
  Top 0.279: U3.68 53.32,41.89 57.15,45.72
  Top 0.305: SV2.9 57.15,45.72
N$40
  Top 0.279: U3.69 52.82,42.66 54.61,44.45
  Top 0.305: SV2.10 54.61,44.45
N$41
  Top 0.279: U3.72 51.32,46.99 51.32,47.51
  Top 0.305: SV3.1 51.52,48.26 arc90 51.32,48.06 51.32,46.99
N$42
  Top 0.279: U3.58 57.21,32.96 57.15,33.02 57.15,34.61 58.1,36.2
  Top 0.305: 58.1,36.2 77.47,46.99
  Top 0.406: SV2.1 77.47,46.99
N$44
  Top 0.279: 59.36,24.46 59.69,24.46 60.63,24.46 60.96,24.13
  Top 0.305: 60.96,24.13 60.96,15.24 60.96,11.43 UART1.3 | U3.41 59.69,24.46
N$45  (via drill 0.51)
  Top 0.279: U3.42 61.4,24.96 62.23,24.13
  Top 0.305: 62.23,24.13 62.23,20.32 v62.23,19.05
  Bottom 0.406: UART1.1 74.93,6.35 71.75,12.06 62.23,12.06 v62.23,19.05
N$47
  Top 0.279: U3.27 50.32,18.89 49.53,18.1 49.53,10.16
  Top 0.305: 49.53,10.16 53.66,6.03 56.2,6.03 57.15,5.08
  Top 0.406: SV1.2 57.15,5.08
N$48
  Top 0.279: U3.28 50.82,18.43 50.16,17.78 50.16,10.79
  Top 0.305: 50.16,10.79 53.98,6.99 58.1,6.99 59.69,5.4
  Top 0.406: SV1.3 59.69,5.4
N$49
  Top 0.279: U3.29 51.32,17.98 50.8,17.46 50.8,11.31
  Top 0.305: 50.8,11.31 54.18,7.94 59.37,7.94 62.23,5.08
  Top 0.406: SV1.4 62.23,5.08
N$50
  Top 0.279: U3.30 51.82,17.53 51.44,17.14 51.44,11.75
  Top 0.305: 51.44,11.75 54.29,8.89 60.64,8.89 64.77,4.76
  Top 0.406: SV1.5 64.77,4.76
N$51  (via drill 0.51)
  Top 0.279: U3.33 53.32,15.86 v52.7,14.61
  Bottom 0.406: v52.7,14.61 51.75,13.02 51.75,7.62 65.72,7.62 SV1.6
N$52  (via drill 0.51)
  Top 0.279: U3.34 53.82,14.77 v53.34,13.34
  Bottom 0.406: v53.34,13.34 52.7,12.38 52.7,8.57 67.63,8.57 SV1.7
N$53  (via drill 0.51)
  Top 0.279: U3.35 54.32,12.99 v53.66,11.75
  Bottom 0.406: v53.66,11.75 53.66,9.53 69.53,9.53 SV1.8
N$54  (via drill 0.51)
  Top 0.279: U3.36 54.82,11.22 v54.93,10.48
  Bottom 0.406: v54.93,10.48 71.12,10.48 SV1.9
N$55
  Top 0.279: U3.73 50.82,43.18 50.8,43.18 49.53,44.45
  Top 0.305: SV3.2 49.53,44.45
N$56
  Top 0.279: U3.74 50.32,42.39 46.99,45.72
  Top 0.305: SV3.3 46.99,45.72
N$57
  Top 0.279: U3.75 49.82,41.62 44.45,46.99
  Top 0.406: SV3.4 44.45,46.99
N$58
  Top 0.279: U3.76 49.32,40.85 SV3.5
N$59
  Top 0.279: SV3.6 40.64,45.72 41.91,45.72
  Top 0.305: U3.77 48.82,40.08 43.18,45.72 41.91,45.72
N$60
  Top 0.279: U3.78 48.32,39.31 43.18,44.45 | SV3.7 39.37,44.45 40.64,44.45
  Top 0.305: 43.18,44.45 40.64,44.45
N$61
  Top 0.279: U3.79 47.82,38.54 43.18,43.18 | SV3.8 38.73,43.18
  Top 0.305: 43.18,43.18 38.73,43.18
N$62
  Top 0.279: SV3.9 34.29,45.72
  Top 0.305: 34.29,45.72 38.1,41.91 43.18,41.91 47.32,37.77 U3.80
N$63
  Top 0.279: U3.24 48.82,20.25 47.62,19.05 47.62,7.62 49.53,5.08 JPROG.6
N$66  (via drill 0.51)
  Top 0.279: U3.15 41.91,26.96 39.37,30.48
  Top 0.305: 32.83,26.22 C5.1
  Top 0.356: R3.2 27.84,30.48 v34.61,30.48 39.37,30.48 | 32.83,26.22 R4.2 v34.61,27.62
  Bottom 0.356: v34.61,27.62 v34.61,30.48
RAIN_CNT_IN
  Top 0.406: J1.P$7 24.23,30.48 R2.1
  Top 0.508: 20,30.8 J1.P$7 19.37,31.43 RAIN.2
RAIN_COUNT  (via drill 0.51)
  Top 0.305: U3.5 39.37,31.96 v38.1,31.96 36.62,31.96 D2.A
  Bottom 0.305: C11.1 33.02,31.75 37.89,31.75 v38.1,31.96
  Bottom 0.406: R15.1 27.94,24.55 C11.1
SCL1  (via drill 0.51)
  Top 0.279: U3.47 63.5,27.46 v64.77,28.26
  Top 0.305: v65.41,33.02 73.66,33.02 | 73.66,33.02 74.3,33.02 J5.P$4 | R12.2 73.66,33.02
  Bottom 0.279: v64.77,28.26 65.09,28.26 65.09,32.38 v65.41,33.02
SCL2  (via drill 0.51)
  Top 0.279: U3.52 61.48,29.96 v61.59,28.57
  Top 0.305: v63.18,24.45 64.45,13.97 v69.85,13.97
  Top 0.406: R24.2 68.68,16.51 v69.85,16.51 | v69.85,13.97 I2C1.1
  Bottom 0.279: v61.59,28.57 v63.18,24.45
  Bottom 0.406: v69.85,16.51 v69.85,13.97
SDA1  (via drill 0.51)
  Top 0.279: U3.46 64.42,26.96 v66.04,27.3
  Top 0.305: R14.2 v73.66,27.94 73.66,29.21 74.3,29.84 J5.P$3
  Bottom 0.305: 66.36,27.3 67.31,27.94 v73.66,27.94
  Bottom 0.406: v66.04,27.3 66.36,27.3
SDA2  (via drill 0.51)
  Top 0.279: U3.53 62.21,30.46 v62.55,29.84
  Top 0.305: R23.2 72.07,15.24 66.04,15.24 v64.77,24.13
  Top 0.406: R23.2 75.35,16.93 I2C1.3
  Bottom 0.305: v62.55,29.84 v64.77,24.13
SUN_ADC_IN  (via drill 0.51)
  Top 0.305: U3.17 39.09,25.96 R10.2 38.7,26.35 C10.1
  Top 0.356: R8.2 26.67,26.67 29.21,29.53 v38.73,29.53 | v38.73,27.62 38.73,26.31 R10.2
  Bottom 0.356: v38.73,29.53 v38.73,27.62
SUN_IN
  Top 0.457: J1.P$5 23.81,27.94 R8.1
  Bottom 0.508: SUN.2 16.51,24.13 J1.P$5
SW_S1  (via drill 0.51)
  Top 0.254: U3.37 55.32,24.13 v55.24,24.13 | U1.13 22.25,36.2 v26.67,36.2 | v41.59,36.51 v46.04,36.51
  Top 0.279: U3.37 55.32,11.99
  Top 0.305: 55.32,11.99 57.47,9.84 72.07,9.84 74.93,7.62 80.64,7.62
  Top 0.356: S1.4 80.64,7.62 S1.3
  Bottom 0.254: v55.24,24.13 55.24,22.86 46.04,22.86 v46.04,36.51 | v26.67,36.2 41.27,36.2 v41.59,36.51
SW_S2  (via drill 0.51)
  Top 0.254: U1.12 21.52,34.92 v26.67,34.92 | U3.38 55.82,23.43 v56.52,24.13 | v45.09,35.24 42.23,35.24 v41.91,34.92
  Top 0.279: U3.38 55.82,12.76
  Top 0.305: 55.82,12.76 57.78,10.79 72.71,10.79 74.3,10.16 79.38,10.16 S2.4
  Top 0.356: S2.3 S2.4
  Bottom 0.254: v26.67,34.92 v41.91,34.92 | v56.52,24.13 55.88,23.5 55.88,22.23 45.4,22.23 45.4,30.8 45.09,33.34 v45.09,35.24
USB_D+
  Top 0.279: 13.34,46.04 19.37,46.04
  Top 0.305: 19.37,46.04 20.64,46.99 23.75,46.99 U1.3 | USB.3_D+ 13.34,46.04
USB_D-
  Top 0.305: U1.4 23.24,45.72 20.32,45.72 19.05,44.77 17.14,44.77 16.19,43.81 14.13,43.81 USB.2_D-
USB_RXD  (via drill 0.51)
  Top 0.254: U1.20 26.67,41.15
  Top 0.279: v56.83,16.83 57.78,17.78 57.78,19.37 56.82,20.65 U3.40
  Top 0.305: 26.67,41.15 v26.67,39.37
  Bottom 0.254: v56.83,16.83 53.34,20.64 44.13,20.64 44.13,30.8 43.5,33.34 43.5,39.37 v26.67,39.37
USB_TXD  (via drill 0.51)
  Top 0.254: U1.21 26.67,41.66
  Top 0.279: U3.39 56.32,19.25 v56.83,18.73
  Top 0.305: 26.67,41.66 26.67,43.81 v26.04,45.09
  Bottom 0.254: 56.83,19.05 54.61,21.27 44.77,21.27 44.77,30.8 44.13,33.34 44.13,42.86 28.26,42.86 v26.04,45.09
  Bottom 0.279: v56.83,18.73 56.83,19.05
WIFI_INT_  (via drill 0.51)
  Top 0.279: U3.13 46.35,27.96 46.35,27.94 46.99,26.35 v54.61,26.35
  Bottom 0.356: v54.61,26.35 55.24,26.35
  Bottom 0.406: 55.24,26.35 58.74,26.35 58.74,23.81 59.05,22.54 69.85,22.54 69.85,25.4 J6.7
WIN_DIR_IN
  Top 0.457: J1.P$4 R5.1
WIND_ADC_IN
  Top 0.279: U3.16 41.38,26.46 39.62,28.57
  Top 0.305: R6.2 30.7,26.35 | C9.1 28.25,26.67
  Top 0.356: 39.62,28.57 31.69,28.57 R6.2 | 30.7,26.35 C9.1 | 28.25,26.67 R5.2
WIND_COUNT  (via drill 0.51)
  Top 0.254: 26.67,33.02 R1.2
  Top 0.279: U3.4 39.3,32.46 37.78,33.97 30.8,33.97 v29.84,33.02
  Top 0.406: v29.84,33.02 26.67,33.02
  Bottom 0.406: R13.1 28.25,29.21 C19.1 v29.84,33.02
WIND_COUNT_IN
  Top 0.457: R1.1 J1.P$8

### Text on the board
tPlace: 1 | 1 | J6 | 1 | Wunder Weather Station | 1 | RV-BUILDERS PRODUCTS 2013 | 1
bPlace: Baro-Temp-Hyg | NOT Ethernet ! | WiFi | PCB Revision B.2
tDocu: 1
bDocu: 1